# Altium schematic sheet PA1616D.SchDoc
size A; SheetNumber: 4; SheetTotal: 5
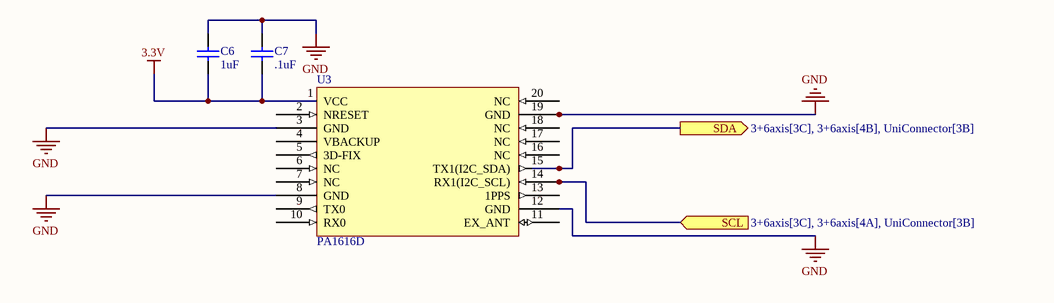
[diagram p0: PA1616D.SchDoc]

## Parts
C6  1uF  [CAPC2013X145X48ML20T23]
C7  .1uF  [CAPC2013X145X48ML20T23]
U3  PA1616D  [PA1616D]

## Ports
SCL (in, see 3+6axis[3C], 3+6axis[4A], UniConnector[3B]), SDA (out, see 3+6axis[3C], 3+6axis[4B], UniConnector[3B])

## Nets
3.3V: C6.1 C7.1 U3.1(VCC)
GND: C6.2 C7.2 U3.3(GND) U3.12(GND) U3.19(GND)
SCL: U3.14(RX1(I2C_SCL)) ; port SCL
SDA: U3.15(TX1(I2C_SDA)) ; port SDA

Not connected (* = marked no-connect by the designer): U3 2(NRESET) 4(VBACKUP) 5(3D-FIX) 6(NC) 7(NC) 8(GND) 9(TX0) 10(RX0) 11(EX_ANT) 13(1PPS) 16(NC) 17(NC) 18(NC) 20(NC)

## Library data of the parts
C6 C7 = CMP-2007-03160-1: Part Number: VJ0805Y103KXBBC31; Manufacturer: Vitramon